# Altium schematic sheet Sheet1.SchDoc
size A4
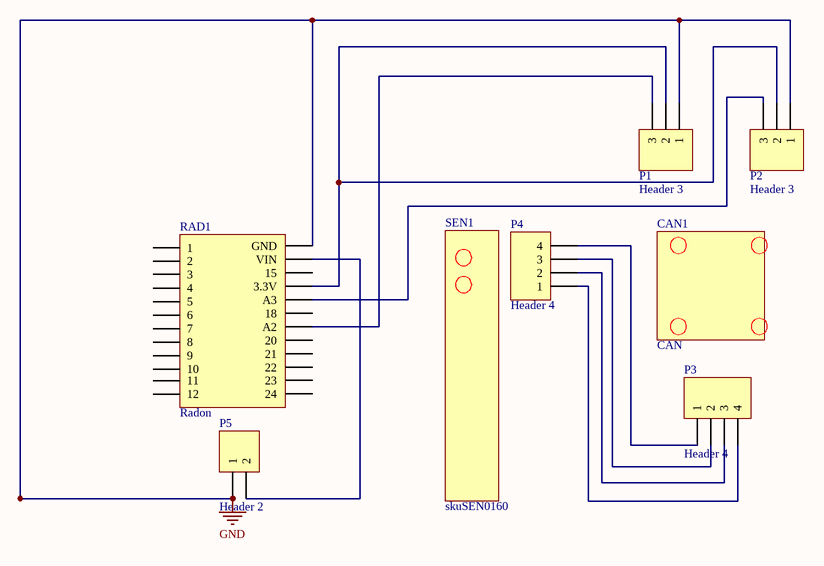
[diagram p0: Sheet1.SchDoc]

## Parts
CAN1  CAN  [CAN]
P1  Header 3  [HDR1X3]
P2  Header 3  [HDR1X3]
P3  Header 4  [HDR1X4]
P4  Header 4  [HDR1X4]
P5  Header 2  [HDR1X2]
RAD1  Radon  [radon]
SEN1  skuSEN0160  [skuSEN0160]

## Nets
GND: P1.1 P2.1 P5.1 RAD1.13(GND)
NetP1_2: P1.2 P2.2 RAD1.16(3.3V)
NetP1_3: P1.3 RAD1.19(A2)
NetP2_3: P2.3 RAD1.17(A3)
NetP3_1: P3.1 P4.4
NetP3_2: P3.2 P4.3
NetP3_3: P3.3 P4.2
NetP3_4: P3.4 P4.1
NetP5_2: P5.2 RAD1.14(VIN)

Not connected (* = marked no-connect by the designer): RAD1 1 2 3 4 5 6 7 8 9 10 11 12 15 18 20 21 22 23 24

## Library data of the parts
CAN1 = CAN: CAN for weight sensor skuSEN0160
P1 P2 = Header 3: Header, 3-Pin; LatestRevisionDate: 17-Jul-2002; LatestRevisionNote: Re-released for DXP Platform.; Publisher: Altium Limited
P3 P4 = Header 4: Header, 4-Pin; LatestRevisionDate: 17-Jul-2002; LatestRevisionNote: Re-released for DXP Platform.; Publisher: Altium Limited
P5 = Header 2: Header, 2-Pin; LatestRevisionDate: 17-Jul-2002; LatestRevisionNote: Re-released for DXP Platform.; Publisher: Altium Limited
RAD1 = Radon: Arduino Radon; LatestRevisionDate: 17-Jul-2002; LatestRevisionNote: Re-released for DXP Platform.; Publisher: Altium Limited
SEN1 = skuSEN0160: weight sensor skuSEN0160